# Altium schematic sheet VideoSignal.SchDoc
size A4
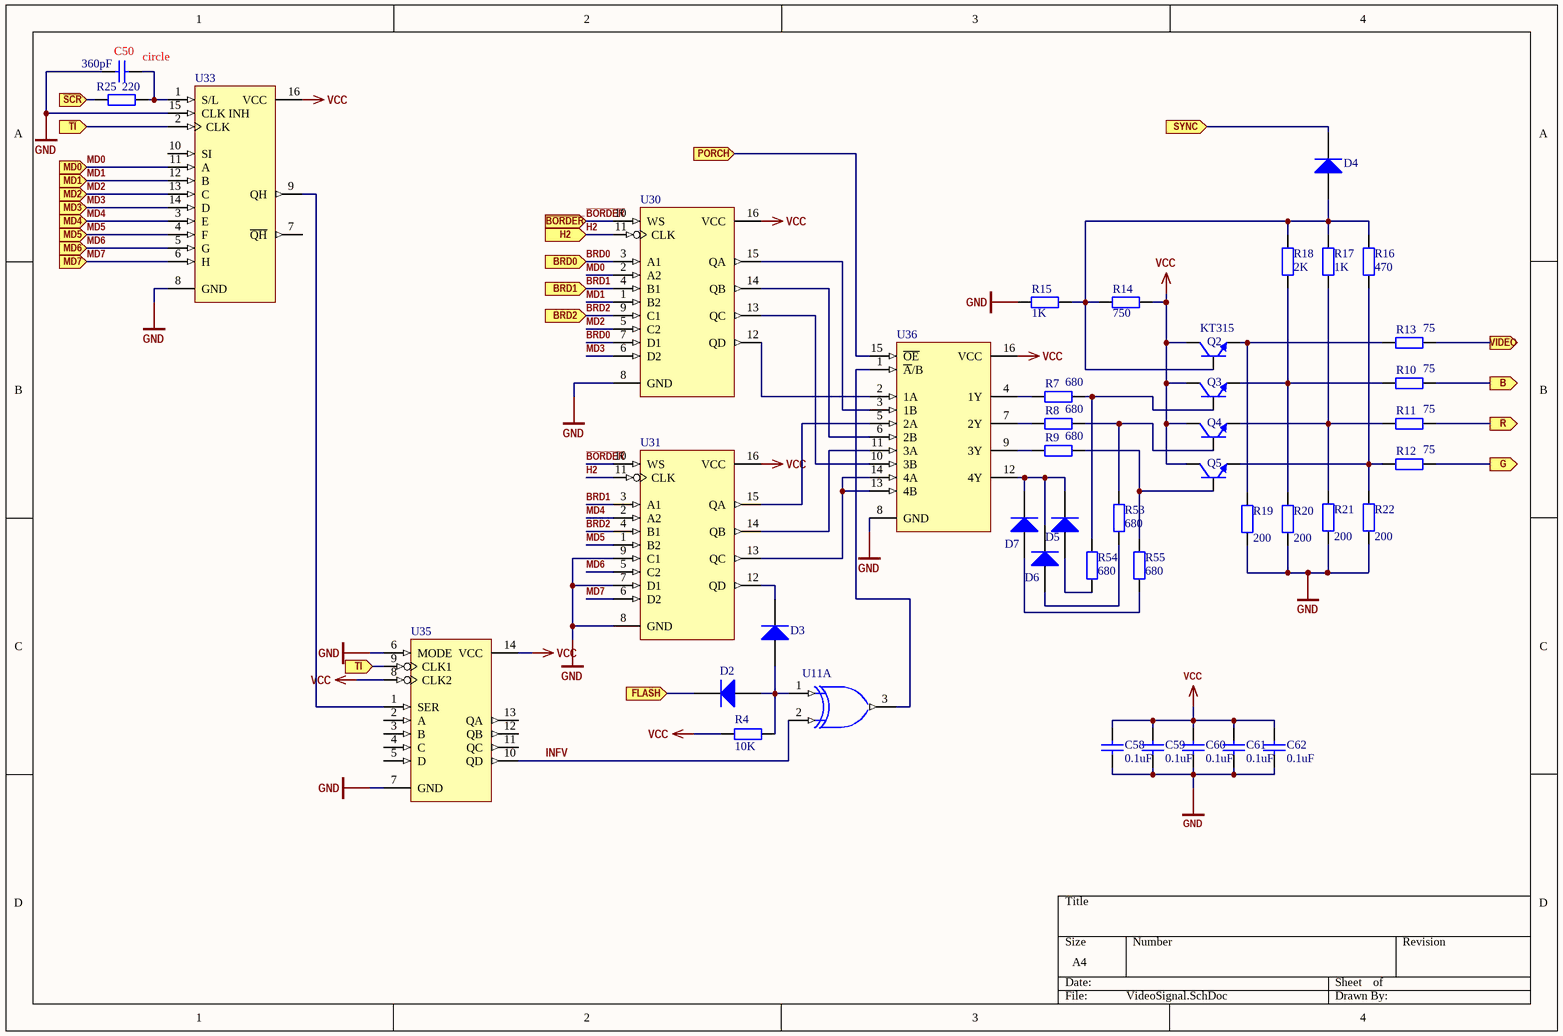
[diagram p0: VideoSignal.SchDoc]

## Parts
C50  circle  value 360pF  [RAD-0.3]
C58  value 0.1uF  [RAD-0.3]  (hidden comment: Cap)
C59  value 0.1uF  [RAD-0.3]  (hidden comment: Cap)
C60  value 0.1uF  [RAD-0.3]  (hidden comment: Cap)
C61  value 0.1uF  [RAD-0.3]  (hidden comment: Cap)
C62  value 0.1uF  [RAD-0.3]  (hidden comment: Cap)
D2  (no value)  [DO-35A]
D3  (no value)  [DO-35A]
D4  Diode 1N4148  [DO-35]  (value not drawn)
D5  Diode 1N4148  [DO-35]  (value not drawn)
D6  Diode 1N4148  [DO-35]  (value not drawn)
D7  Diode 1N4148  [DO-35]  (value not drawn)
Q2  KT315  [D35]
Q3  KT315  [D35]  (value not drawn)
Q4  KT315  [D35]  (value not drawn)
Q5  KT315  [D35]  (value not drawn)
R4  value 10K  [AXIAL-0.4]
R7  value 680  [AXIAL-0.4]
R8  value 680  [AXIAL-0.4]
R9  value 680  [AXIAL-0.4]
R10  value 75  [AXIAL-0.4]
R11  value 75  [AXIAL-0.4]
R12  value 75  [AXIAL-0.4]
R13  value 75  [AXIAL-0.4]
R14  value 750  [AXIAL-0.4]
R15  value 1K  [AXIAL-0.4]
R16  value 470  [AXIAL-0.4]
R17  value 1K  [AXIAL-0.4]
R18  value 2K  [AXIAL-0.4]
R19  value 200  [AXIAL-0.4]
R20  value 200  [AXIAL-0.4]
R21  value 200  [AXIAL-0.4]
R22  value 200  [AXIAL-0.4]
R25  value 220  [AXIAL-0.4]
R53  value 680  [AXIAL-0.4]  (hidden comment: Res2)
R54  value 680  [AXIAL-0.4]  (hidden comment: Res2)
R55  value 680  [AXIAL-0.4]  (hidden comment: Res2)
U11  (no value)  [N014]  (part A of 4)
U30  (no value)  [N016D]
U31  (no value)  [N016D]
U33  (no value)  [N016]
U35  (no value)  [N014]
U36  (no value)  [N016]

## Ports
B (out), BRD0 (in), BRD1 (in), BRD2 (in), FLASH (in), G (out), H2 (in), MD0 (in), MD1 (in), MD2 (in), MD3 (in), MD4 (in), MD5 (in), MD6 (in), MD7 (in), PORCH (in), R (out), SYNC (in), TI (in), VIDEO (out), ~{BORDER} (in), ~{SCR} (in), ~{TI} (in)

## Nets
GND: C50.2 C58.1 C59.1 C60.1 C61.1 C62.1 R15.1 R19.1 R20.1 R21.1 R22.1 U11.7(GND) U30.8(GND) U31.7(D1) U31.8(GND) U31.9(C1) U33.8(GND) U33.15(CLK_INH) U35.6(MODE) U35.7(GND) U36.8(GND)
VCC: C58.2 C59.2 C60.2 C61.2 C62.2 Q2.2(C) Q3.2(C) Q4.2(C) Q5.2(C) R4.1 R14.2 U11.14(VCC) U30.16(VCC) U31.16(VCC) U33.16(VCC) U35.8(CLK2) U35.14(VCC) U36.16(VCC)
B: R10.2 ; port B
~{BORDER}: U30.10(WS) U31.10(WS) ; port ~{BORDER}
BRD0: U30.3(A1) U30.7(D1) ; port BRD0
BRD1: U30.4(B1) U31.3(A1) ; port BRD1
BRD2: U30.9(C1) U31.4(B1) ; port BRD2
FLASH: D2.2(K) ; port FLASH
G: R12.2 ; port G
H2: U30.11(CLK) U31.11(CLK) ; port H2
INFV: U11.2(B) U35.10(QD)
MD0: U30.2(A2) U33.11(A) ; port MD0
MD1: U30.1(B2) U33.12(B) ; port MD1
MD2: U30.5(C2) U33.13(C) ; port MD2
MD3: U30.6(D2) U33.14(D) ; port MD3
MD4: U31.2(A2) U33.3(E) ; port MD4
MD5: U31.1(B2) U33.4(F) ; port MD5
MD6: U31.5(C2) U33.5(G) ; port MD6
MD7: U31.6(D2) U33.6(H) ; port MD7
PORCH: U36.15(~{OE}) ; port PORCH
R: R11.2 ; port R
~{SCR}: R25.2 ; port ~{SCR}
SYNC: D4.2(K) ; port SYNC
~{TI}: U33.2(CLK) ; port ~{TI}
TI: U35.9(CLK1) ; port TI
VIDEO: R13.2 ; port VIDEO
NetC50_1: C50.1 R25.1 U33.1(S/L)
NetD2_1: D2.1(A) D3.1(A) R4.2 U11.1(A)
NetD3_2: D3.2(K) U31.12(QD)
NetD4_1: D4.1(A) Q2.3(B) R14.1 R15.2 R16.2 R17.2 R18.2
NetD5_1: D5.1(A) R54.1
NetD5_2: D5.2(K) D6.2(K) D7.2(K) U36.12(4Y)
NetD6_1: D6.1(A) R53.1
NetD7_1: D7.1(A) R55.1
NetQ2_1: Q2.1(E) R13.1 R19.2
NetQ3_1: Q3.1(E) R10.1 R18.1 R20.2
NetQ3_3: Q3.3(B) R7.2 R54.2
NetQ4_1: Q4.1(E) R11.1 R17.1 R21.2
NetQ4_3: Q4.3(B) R8.2 R53.2
NetQ5_1: Q5.1(E) R12.1 R16.1 R22.2
NetQ5_3: Q5.3(B) R9.2 R55.2
NetR7_1: R7.1 U36.4(1Y)
NetR8_1: R8.1 U36.7(2Y)
NetR9_1: R9.1 U36.9(3Y)
NetU11_3: U11.3(Y) U36.1(~{A}/B)
NetU30_12: U30.12(QD) U36.2(1A)
NetU30_13: U30.13(QC) U36.10(3B)
NetU30_14: U30.14(QB) U36.6(2B)
NetU30_15: U30.15(QA) U36.3(1B)
NetU31_13: U31.13(QC) U36.13(4B) U36.14(4A)
NetU31_14: U31.14(QB) U36.11(3A)
NetU31_15: U31.15(QA) U36.5(2A)
NetU33_9: U33.9(QH) U35.1(SER)

Not connected (* = marked no-connect by the designer): U33 7(~{QH}) 10(SI); U35 2(A) 3(B) 4(C) 5(D) 11(QC) 12(QB) 13(QA)

## Library data of the parts
C50 C58-C62 = Cap: Capacitor; Published: 8-Jun-2000; LatestRevisionDate: 17-Jul-2002; LatestRevisionNote: Re-released for DXP Platform.; PackageReference: RAD-0.3; Publisher: Altium Limited; PackageDescription: Radial Cap, Thru-Hole; 2 Leads; 0.3 in Pin Spacing
D2 D3 = Diode 1N4149: Computer Diode; Published: 8-Jun-2000; LatestRevisionDate: 17-Jul-2002; LatestRevisionNote: Re-released for DXP Platform.; DatasheetVersion: 1989; PackageReference: DO-35A; Publisher: Altium Limited; PackageDescription: Diode, Axial; Body 4.6 x 1.9 mm (LxDia. max), Lead Dia. 0.53 mm (max); Code_JEDEC: DO-204-AH; ComponentLink1Description: Manufacturer Link; ComponentLink1URL: http://www.national.com/; PackageVersion: 1989
D4-D7 = Diode 1N4148: High Conductance Fast Diode; Published: 8-Jun-2000; LatestRevisionDate: 17-Jul-2002; LatestRevisionNote: Re-released for DXP Platform.; DatasheetVersion: 1997; PackageReference: DO-35; Publisher: Altium Limited; PackageDescription: Diode, Axial; Body 3.8 x 1.9 mm (LxDia. max), Lead Dia. 0.53 mm (max); Code_JEDEC: DO-204-AH; ComponentLink1Description: Manufacturer Link; ComponentLink1URL: http://www.fairchildsemi.com/; ComponentLink2Description: Datasheet; ComponentLink2URL: http://www.fairchildsemi.com/ds/1N%2F1N4148.pdf
Q2-Q5 = KT315: NPN General Purpose Amplifier; Published: 8-Jun-2000; LatestRevisionDate: 15-Jan-2003; LatestRevisionNote: PCB Footprint 'BCY-W3/D4.7' replaced; DatasheetVersion: 1997; PackageVersion: Sep-1998; PackageReference: TO-92A; Publisher: Altium Limited; PackageDescription: TO, Flat Index; 3 In-Line, Axial Leads; Body Dia. 4.5mm; Leads 0.51 x 0.48 mm (max); ComponentLink1Description: Manufacturer Link; ComponentLink1URL: http://www.fairchildsemi.com/; ComponentLink2Description: Datasheet; ComponentLink2URL: http://www.fairchildsemi.com/ds/2N%2F2N3904.pdf
R4 R7-R22 R25 R53-R55 = Res2: Resistor; Published: 8-Jun-2000; LatestRevisionDate: 17-Jul-2002; LatestRevisionNote: Re-released for DXP Platform.; PackageReference: AXIAL-0.4; Publisher: Altium Limited; PackageDescription: Axial Device, Thru-Hole; 2 Leads; 0.4 in Pin Spacing
U11 = SN74HC86N: Quadruple 2-Input Exclusive-OR Gate; Published: 8-Jun-2000; LatestRevisionDate: 04-Mar-2005; LatestRevisionNote: Stylized 3D Model Added.; DatasheetVersion: Aug-1999; PackageVersion: Oct-1995; PackageReference: N014; Publisher: Altium Limited; PackageDescription: DIP; 14 Leads; Row Spacing 7.62 mm; Pitch 2.54 mm; ComponentLink1Description: Manufacturer Link; ComponentLink1URL: http://www.ti.com/; ComponentLink2Description: Datasheet; ComponentLink2URL: http://www-s.ti.com/sc/ds/SN54HC86.pdf
U30 U31 = SN74HC298N: Quadruple 2-Input Multiplexer with Storage; Published: 8-Jun-2000; LatestRevisionDate: 04-Mar-2005; LatestRevisionNote: Stylized 3D Model Added.; DatasheetVersion: Jun-1989; PackageVersion: Oct-1995; PackageReference: N016D; Publisher: Altium Limited; PackageDescription: DIP; 16 Leads; Row Spacing 7.62 mm; Pitch 2.54 mm; Code_JEDEC: MS-001-BB; ComponentLink1Description: Manufacturer Link; ComponentLink1URL: http://www.ti.com/
U33 = SN74HC165N: 8-Bit Parallel-Load Shift Register; Published: 8-Jun-2000; LatestRevisionDate: 04-Mar-2005; LatestRevisionNote: Stylized 3D Model Added.; DatasheetVersion: May-1997; PackageVersion: Oct-1995; PackageReference: N016; Publisher: Altium Limited; PackageDescription: DIP; 16 Leads; Row Spacing 7.62 mm; Pitch 2.54 mm; Code_JEDEC: MS-001-BB; ComponentLink1Description: Manufacturer Link; ComponentLink1URL: http://www.ti.com/; ComponentLink2Description: Datasheet; ComponentLink2URL: http://www-s.ti.com/sc/ds/sn74hc165.pdf
U35 = SN74LS95BN: 4-Bit Parallel-Access Shift Register; ComponentAvailability: Obsolete; Published: 8-Jun-2000; LatestRevisionDate: 04-Mar-2005; LatestRevisionNote: Stylized 3D Model Added.; DatasheetVersion: Mar-1988; PackageVersion: Oct-1995; PackageReference: N014; Publisher: Altium Limited; PackageDescription: DIP; 14 Leads; Row Spacing 7.62 mm; Pitch 2.54 mm; ComponentLink1Description: Manufacturer Link; ComponentLink1URL: http://www.ti.com/; ComponentLink2Description: Datasheet; ComponentLink2URL: http://www-s.ti.com/sc/ds/sn5495a.pdf
U36 = SN74HC257N: Quadruple 2-Line to 1-Line Data Selector/Multiplexer with 3-State Outputs; Published: 8-Jun-2000; LatestRevisionDate: 04-Mar-2005; LatestRevisionNote: Stylized 3D Model Added.; DatasheetVersion: Jun-1989; PackageVersion: Oct-1995; PackageReference: N016; Publisher: Altium Limited; PackageDescription: DIP; 16 Leads; Row Spacing 7.62 mm; Pitch 2.54 mm; Code_JEDEC: MS-001-BB; ComponentLink1Description: Manufacturer Link; ComponentLink1URL: http://www.ti.com/; ComponentLink2Description: Datasheet; ComponentLink2URL: http://www-s.ti.com/sc/ds/sn74hc257.pdf